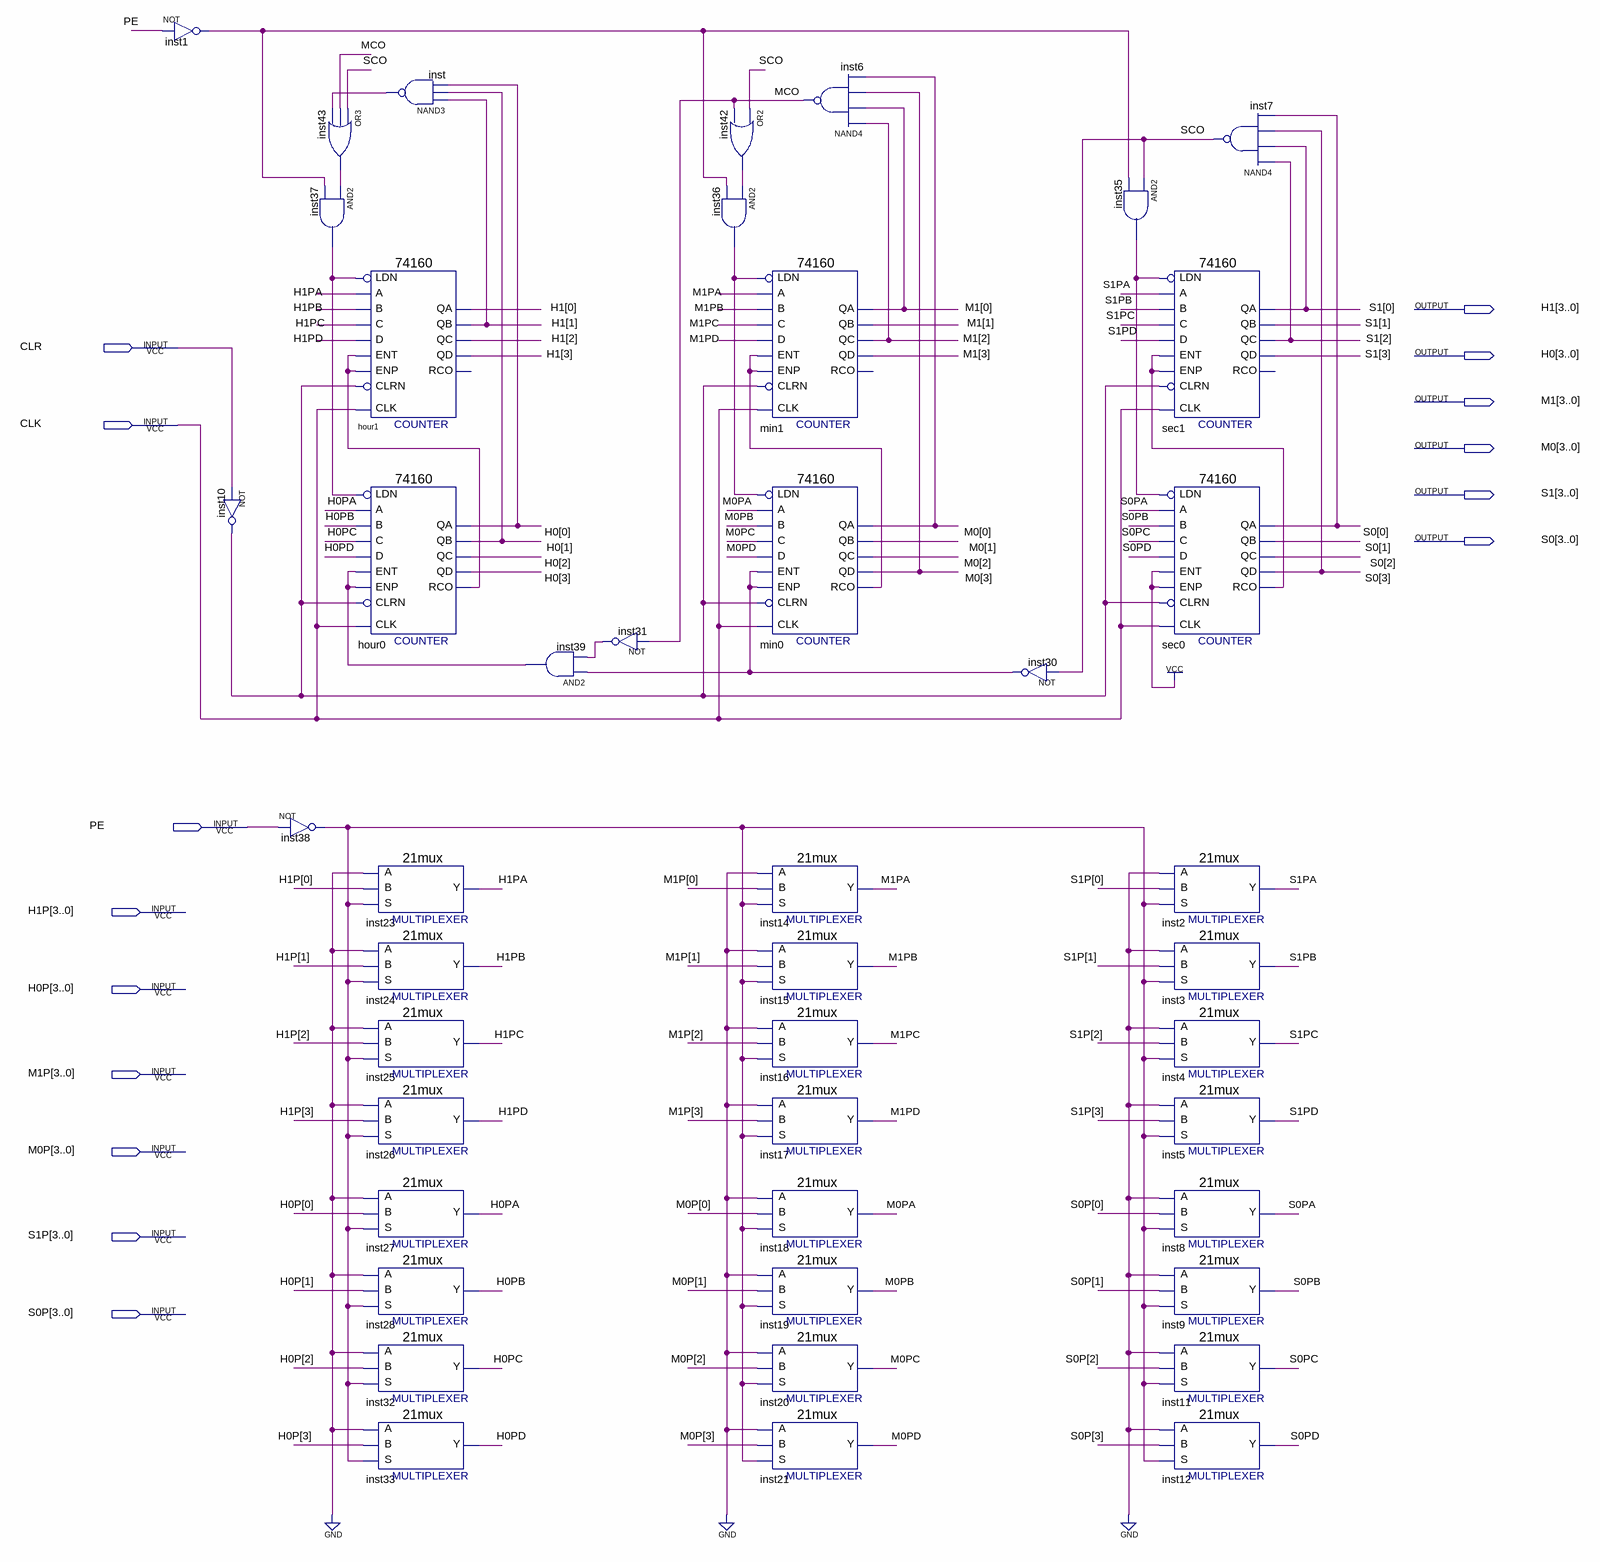
[diagram p0: schematic sheet]
// Quartus schematic CLOCK_COUNTER.bdf as structural Verilog: 44 symbols, 15 pins
module CLOCK_COUNTER (
  input  CLR,
  input  CLK,
  input  PE,
  input  [3:0] H1P,
  input  [3:0] H0P,
  input  [3:0] M1P,
  input  [3:0] M0P,
  input  [3:0] S1P,
  input  [3:0] S0P,
  output [3:0] H1,
  output [3:0] H0,
  output [3:0] M1,
  output [3:0] M0,
  output [3:0] S1,
  output [3:0] S0
);

  wire H0PA, H0PB, H0PC, H0PD, H1PA, H1PB, H1PC, H1PD, hour0_rco, inst1_out, inst10_out, inst30_out,
       inst31_out, inst35_out, inst36_out, inst37_out, inst38_out, inst39_out, inst42_out, inst43_out,
       inst_out, M0PA, M0PB, M0PC, M0PD, M1PA, M1PB, M1PC, M1PD, MCO, min0_rco, S0PA, S0PB, S0PC, S0PD, S1PA,
       S1PB, S1PC, S1PD, SCO, sec0_rco;

  not inst1 (inst1_out, PE);
  not inst10 (inst10_out, CLR);
  not inst38 (inst38_out, PE);
  or inst43 (inst43_out, SCO, MCO, inst_out);
  and inst37 (inst37_out, inst43_out, inst1_out);
  \74160  hour1 (
    .CLK(CLK), .ENT(hour0_rco), .A(H1PA), .B(H1PB), .C(H1PC), .D(H1PD), .LDN(inst37_out), .ENP(hour0_rco),
    .CLRN(inst10_out), .QD(H1[3]), .QA(H1[0]), .QB(H1[1]), .QC(H1[2]));  // open: RCO
  \74160  hour0 (
    .CLK(CLK), .ENT(inst39_out), .A(H0PA), .B(H0PB), .C(H0PC), .D(H0PD), .LDN(inst37_out), .ENP(inst39_out),
    .CLRN(inst10_out), .QD(H0[3]), .QA(H0[0]), .QB(H0[1]), .QC(H0[2]), .RCO(hour0_rco));
  nand inst (inst_out, H1[1], H0[1], H0[0]);
  \21mux  inst23 (.S(inst38_out), .B(H1P[0]), .A(1'b0), .Y(H1PA));
  \21mux  inst24 (.S(inst38_out), .B(H1P[1]), .A(1'b0), .Y(H1PB));
  \21mux  inst25 (.S(inst38_out), .B(H1P[2]), .A(1'b0), .Y(H1PC));
  \21mux  inst26 (.S(inst38_out), .B(H1P[3]), .A(1'b0), .Y(H1PD));
  \21mux  inst27 (.S(inst38_out), .B(H0P[0]), .A(1'b0), .Y(H0PA));
  \21mux  inst28 (.S(inst38_out), .B(H0P[1]), .A(1'b0), .Y(H0PB));
  \21mux  inst32 (.S(inst38_out), .B(H0P[2]), .A(1'b0), .Y(H0PC));
  \21mux  inst33 (.S(inst38_out), .B(H0P[3]), .A(1'b0), .Y(H0PD));
  and inst39 (inst39_out, inst30_out, inst31_out);
  not inst31 (inst31_out, MCO);
  or inst42 (inst42_out, SCO, MCO);
  and inst36 (inst36_out, inst42_out, inst1_out);
  \74160  min1 (
    .CLK(CLK), .ENT(min0_rco), .A(M1PA), .B(M1PB), .C(M1PC), .D(M1PD), .LDN(inst36_out), .ENP(min0_rco),
    .CLRN(inst10_out), .QD(M1[3]), .QA(M1[0]), .QB(M1[1]), .QC(M1[2]));  // open: RCO
  \74160  min0 (
    .CLK(CLK), .ENT(inst30_out), .A(M0PA), .B(M0PB), .C(M0PC), .D(M0PD), .LDN(inst36_out), .ENP(inst30_out),
    .CLRN(inst10_out), .QD(M0[3]), .QA(M0[0]), .QB(M0[1]), .QC(M0[2]), .RCO(min0_rco));
  \21mux  inst14 (.S(inst38_out), .B(M1P[0]), .A(1'b0), .Y(M1PA));
  \21mux  inst15 (.S(inst38_out), .B(M1P[1]), .A(1'b0), .Y(M1PB));
  \21mux  inst16 (.S(inst38_out), .B(M1P[2]), .A(1'b0), .Y(M1PC));
  \21mux  inst17 (.S(inst38_out), .B(M1P[3]), .A(1'b0), .Y(M1PD));
  \21mux  inst18 (.S(inst38_out), .B(M0P[0]), .A(1'b0), .Y(M0PA));
  \21mux  inst19 (.S(inst38_out), .B(M0P[1]), .A(1'b0), .Y(M0PB));
  \21mux  inst20 (.S(inst38_out), .B(M0P[2]), .A(1'b0), .Y(M0PC));
  \21mux  inst21 (.S(inst38_out), .B(M0P[3]), .A(1'b0), .Y(M0PD));
  nand inst6 (MCO, M1[2], M1[0], M0[3], M0[0]);
  not inst30 (inst30_out, SCO);
  and inst35 (inst35_out, SCO, inst1_out);
  \74160  sec1 (
    .CLK(CLK), .ENT(sec0_rco), .A(S1PA), .B(S1PB), .C(S1PC), .D(S1PD), .LDN(inst35_out), .ENP(sec0_rco),
    .CLRN(inst10_out), .QD(S1[3]), .QA(S1[0]), .QB(S1[1]), .QC(S1[2]));  // open: RCO
  \74160  sec0 (
    .CLK(CLK), .ENT(1'b1), .A(S0PA), .B(S0PB), .C(S0PC), .D(S0PD), .LDN(inst35_out), .ENP(1'b1),
    .CLRN(inst10_out), .QD(S0[3]), .QA(S0[0]), .QB(S0[1]), .QC(S0[2]), .RCO(sec0_rco));
  \21mux  inst2 (.S(inst38_out), .B(S1P[0]), .A(1'b0), .Y(S1PA));
  \21mux  inst3 (.S(inst38_out), .B(S1P[1]), .A(1'b0), .Y(S1PB));
  \21mux  inst4 (.S(inst38_out), .B(S1P[2]), .A(1'b0), .Y(S1PC));
  \21mux  inst5 (.S(inst38_out), .B(S1P[3]), .A(1'b0), .Y(S1PD));
  \21mux  inst8 (.S(inst38_out), .B(S0P[0]), .A(1'b0), .Y(S0PA));
  \21mux  inst9 (.S(inst38_out), .B(S0P[1]), .A(1'b0), .Y(S0PB));
  \21mux  inst11 (.S(inst38_out), .B(S0P[2]), .A(1'b0), .Y(S0PC));
  \21mux  inst12 (.S(inst38_out), .B(S0P[3]), .A(1'b0), .Y(S0PD));
  nand inst7 (SCO, S1[2], S1[0], S0[3], S0[0]);
endmodule
